# EasyEDA Pro project twibby.epro

# Schematic Schematic
Board Name: rev1.0; Create Date: 2025-04-24; Page Name: P1; Project Name: Twibby; Schematic Name: Schematic; Update Date: 2025-04-24; Company: EasyEDA.com; Page Size: A4; Version: V1.0
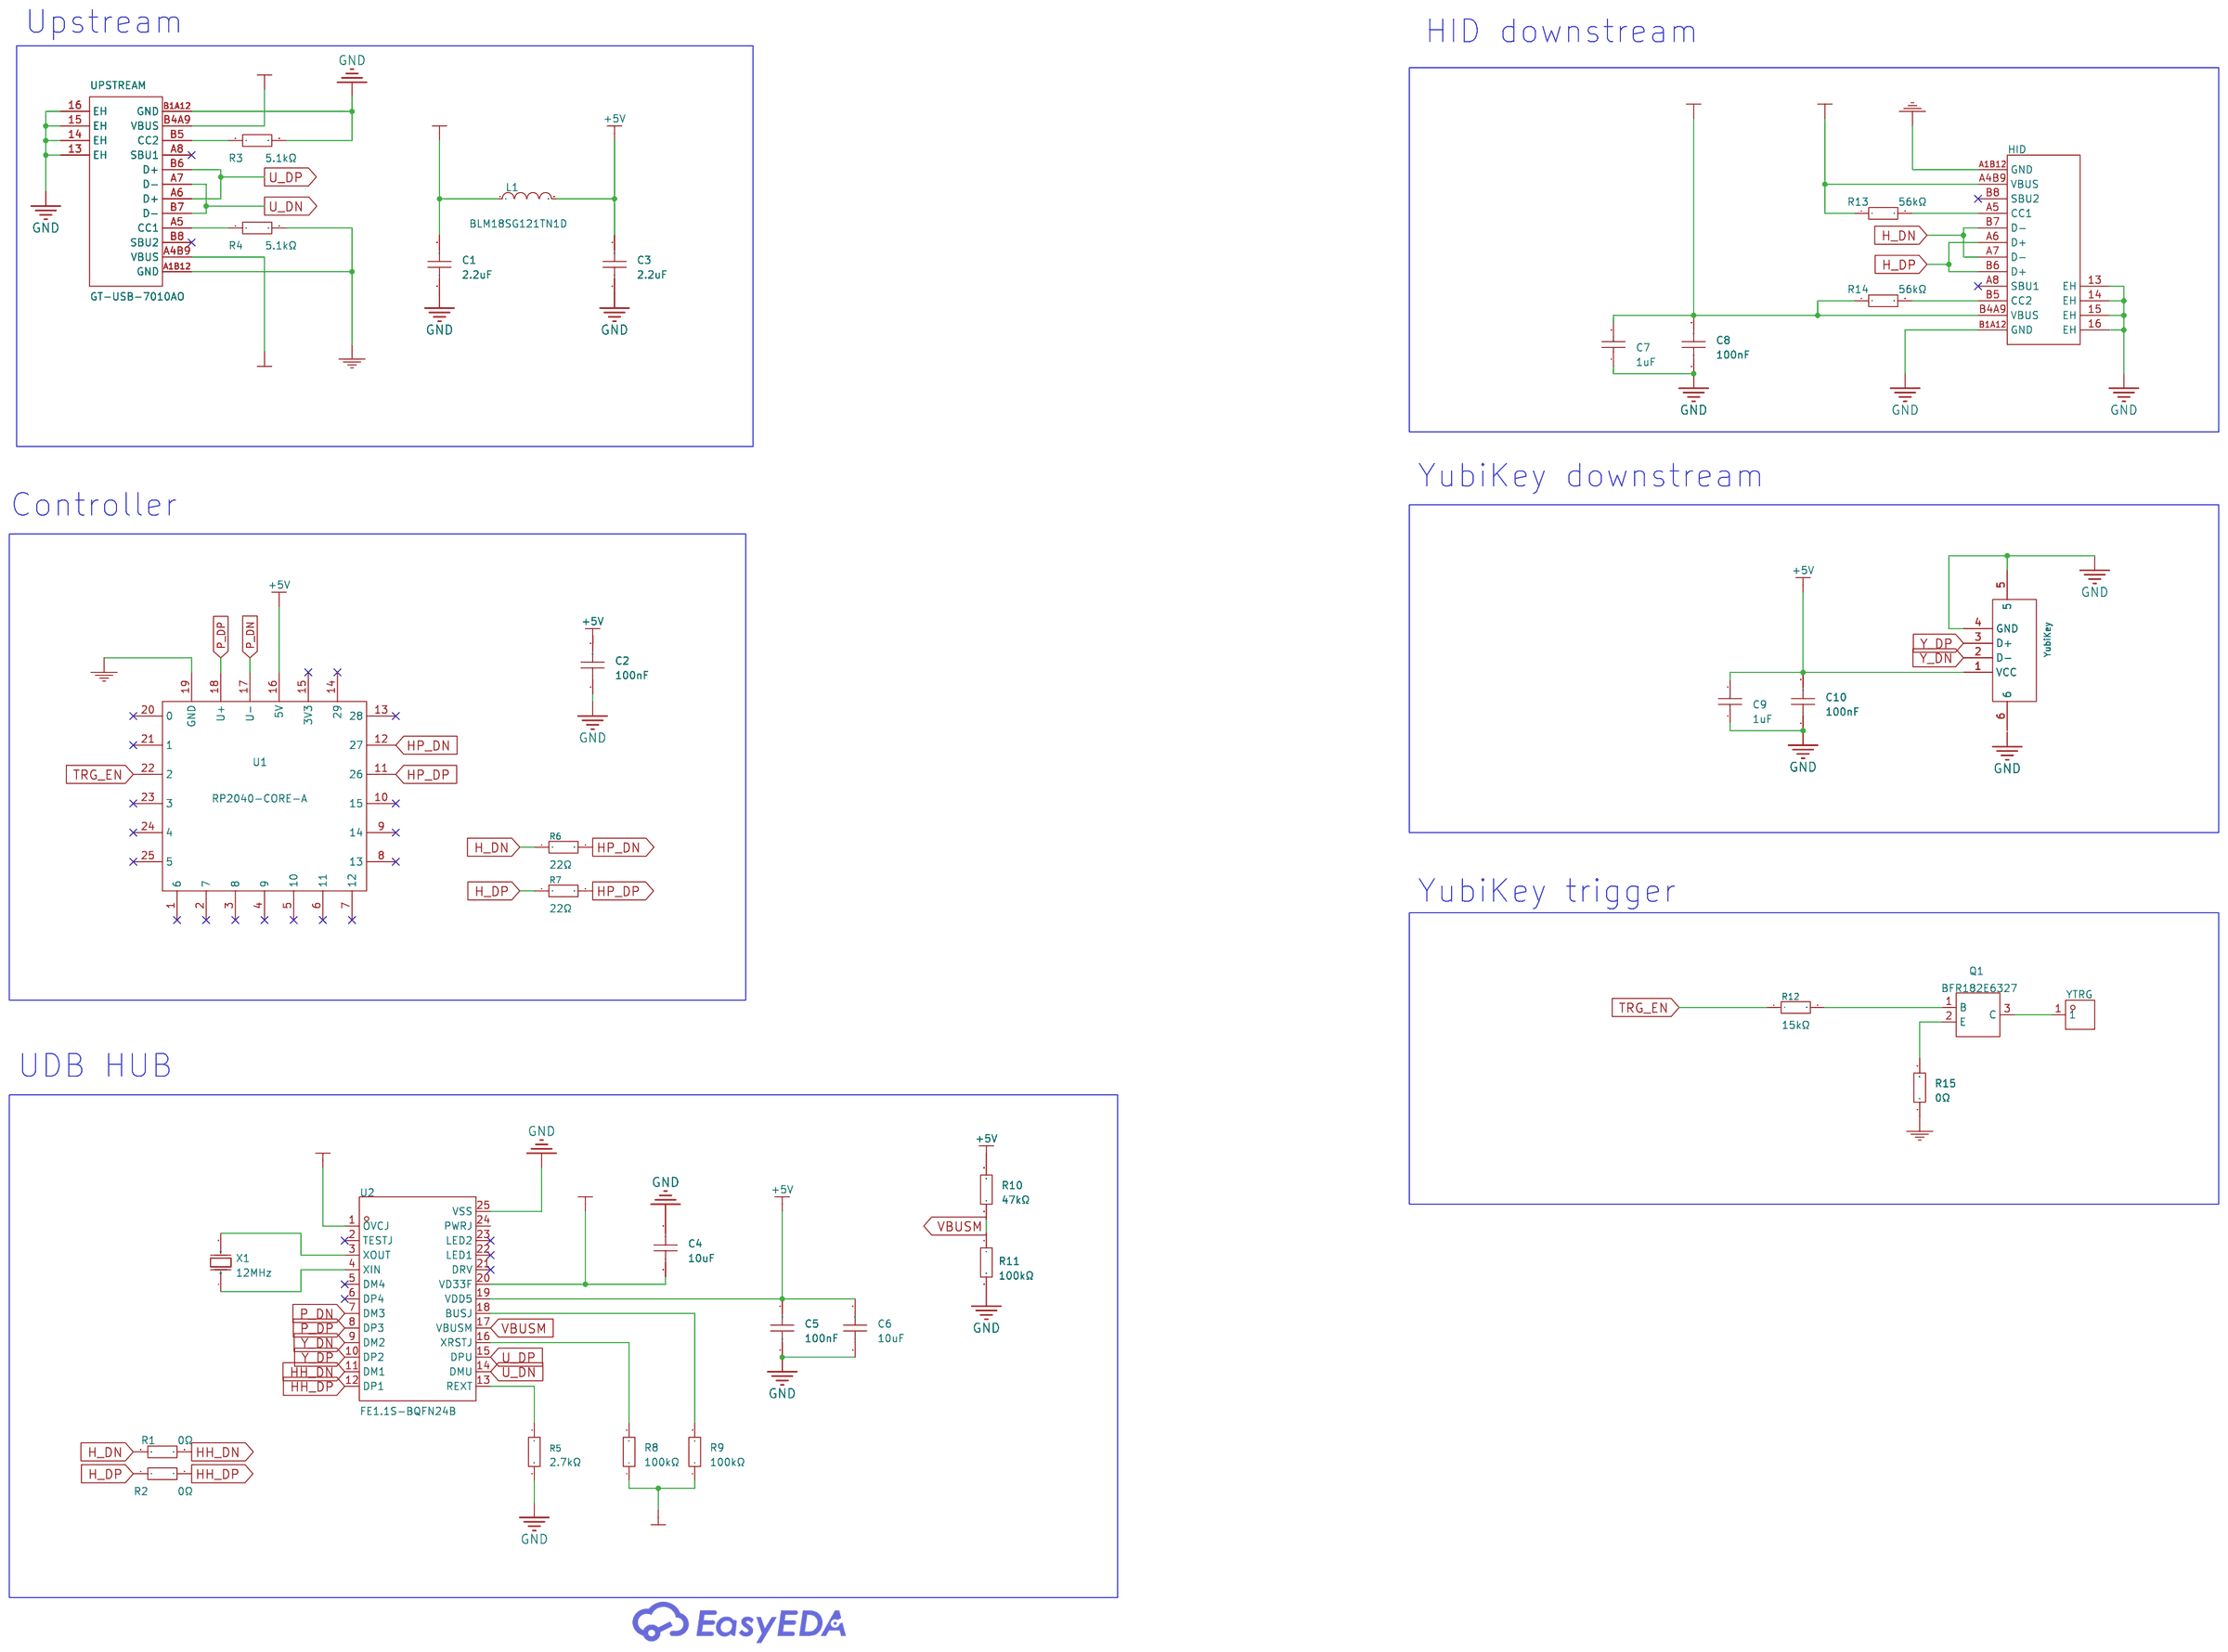
[diagram p0: schematic sheet]

## Parts
C1  2.2uF  [C0805]
C2  100nF  [C0805]
C3  2.2uF  [C0805]
C4  10uF  [C0603]
C5  100nF  [C0402]
C6  10uF  [C0603]
C7  1uF  [C0805]
C8  100nF  [C0805]
C9  1uF  [C0805]
C10  100nF  [C0805]
HID  GT-USB-7010AO  [USB-C-SMD_TYPEC-304J-BCP16]
L1  BLM18SG121TN1D  [L0603]
Q1  BFR182E6327  [SOT-23-3_L2.9-W1.3-P1.90-LS2.4-BR]
R1  0Ω  [R0603]
R2  0Ω  [R0603]
R3  5.1kΩ  [R0402]
R4  5.1kΩ  [R0402]
R5  2.7kΩ  [R0603]
R6  22Ω  [R0402]
R7  22Ω  [R0402]
R8  100kΩ  [R0402]
R9  100kΩ  [R0402]
R10  47kΩ  [R0402]
R11  100kΩ  [R0402]
R12  15kΩ  [R0603]
R13  56kΩ  [R0603]
R14  56kΩ  [R0603]
R15  0Ω  [R0603]
U1  RP2040-CORE-A  [RP2040-CORE-A]
U2  FE1.1S-BQFN24B  [WQFN-24_L4.0-W4.0-P0.50-TL-EP2.7]
UPSTREAM  GT-USB-7010AO  [USB-C-SMD_TYPEC-304J-BCP16]
X1  12MHz  [OSC-SMD_L5.0-W3.2]
YTRG  5017  [CONN-SMD_5017]
YubiKey  912-121A2026S10100  [USB-A-TH_C42425]

## Library data of the parts
C1 C3 = CL21A225KBQNNNE: Capacitance: Tolerance:±10% Tolerance:±10% Voltage Rated: Temperature Coefficient:; LCSC Part Name: 2.2uF ±10% 50V; Supplier Part: C377773; Manufacturer: SAMSUNG(三星); Supplier Footprint: 0805; JLCPCB Part Class: Basic Part; Datasheet: https://atta.szlcsc.com/upload/public/pdf/source/20160218/1457707763339.pdf; Supplier: LCSC; Tolerance: ±10%
C2 C8 C10 = CL21B104KCFNNNE: Capacitance: Tolerance:±10% Tolerance:±10% Voltage Rated: Temperature Coefficient:; LCSC Part Name: 100nF ±10% 100V; Supplier Part: C28233; Manufacturer: SAMSUNG(三星); Supplier Footprint: 0805; JLCPCB Part Class: Basic Part; Datasheet: https://atta.szlcsc.com/upload/public/pdf/source/20160218/1457707763339.pdf; Supplier: LCSC; Tolerance: ±10%
C4 C6 = CL10A106KP8NNNC: Capacitance: Tolerance:±10% Tolerance:±10% Voltage Rated: Temperature Coefficient:; LCSC Part Name: 10uF ±10% 10V; Supplier Part: C19702; Manufacturer: SAMSUNG(三星); Supplier Footprint: 0603; JLCPCB Part Class: Basic Part; Datasheet: https://atta.szlcsc.com/upload/public/pdf/source/20160218/1457707763339.pdf; Supplier: LCSC; Tolerance: ±10%
C5 = 100nF: Supplier: LCSC; Manufacturer Part: CL05B104KO5NNNC; Manufacturer: SAMSUNG(三星); Supplier Part: C1525; JLCPCB Part Class: Basic Part; nameAlias: Value; spicePre: C; spiceSymbolName: CL05B104KO5NNNC
C7 C9 = 0805B105K500NT_C215803: Capacitance:1uF Tolerance:±10% Tolerance:±10% Voltage Rating:50V Temperature Coefficient:X7R; LCSC Part Name: 1uF ±10% 50V; Supplier Part: C215803; Manufacturer: FH(风华); Manufacturer Part: 0805B105K500NT; Supplier Footprint: 0805; JLCPCB Part Class: Extended Part; Datasheet: https://atta.szlcsc.com/upload/public/pdf/source/20180530/C215803_D57791C2287FC18831C4E0C7838E6BEC.pdf; Supplier: LCSC; Tolerance: ±10%; Voltage Rating: 50V; Temperature Coefficient: X7R
HID UPSTREAM = GT-USB-7010AO: Connector Type:Type-C Protocol Standard:USB 2.0 Gender:Female Mounting Type:Horizontal attachment Number of Contacts:16P Number of Ports:1 Current Rating-Power:5A Voltage Rating:24V Connect-Disconnect Life:10,000 times Center Height:1.68mm Length:7.35mm D; LCSC Part Name: Type-C 母 卧贴; Supplier Part: C963413; Manufacturer: G-Switch(品赞); Supplier Footprint: SMD; JLCPCB Part Class: Extended Part; Datasheet: https://atta.szlcsc.com/upload/public/pdf/source/20231219/85271B2F6473C1B77DCA32EC6F809B43.pdf; Supplier: LCSC; Connector Type: Type-C; Protocol Standard: USB 2.0; Gender: Female; Mounting Type: Horizontal attachment; Number of Contacts: 16P; Number of Ports: 1; Current Rating-Power: 5A; Voltage Rating: 24V; Connect-Disconnect Life: 10,000 times; Center Height: 1.68mm; Length: 7.35mm; Detection color: Orange; Operating Temperature: -40℃~+85℃
L1 = BLM18SG121TN1D: Impedance @ Frequency:120Ω@100MHz Tolerance:±25% Tolerance:±25% DC Resistance:25mΩ Current Rating:3A Circuits:1; LCSC Part Name: 单路 0603磁珠 阻抗120Ω@100MHz; Supplier Part: C113030; Manufacturer: muRata(村田); Supplier Footprint: 0603; JLCPCB Part Class: Extended Part; Datasheet: https://atta.szlcsc.com/upload/public/pdf/source/20170523/1495533956547.pdf; Supplier: LCSC; Impedance @ Frequency: 120Ω@100MHz; Tolerance: ±25%; DC Resistance: 25mΩ; Current Rating: 3A; Circuits: 1
Q1 = BFR182E6327: Supplier: LCSC; Supplier Part: C178311; Manufacturer: Infineon(英飞凌); JLCPCB Part Class: Extended Part; Contributor: LCSC; spicePre: Q
R1 R2 = 0603WAF0000T5E: Type:Thick Film Resistors Resistance: Tolerance:±1% Tolerance:±1% Power(Watts): Overload Voltage (Max): Operating Temperature Range:-55℃~+155℃ Operating Temperature Range:-55℃~+155℃; LCSC Part Name: 0Ω ±1% 100mW 厚膜电阻; Supplier Part: C21189; Manufacturer: UNI-ROYAL(厚声); Supplier Footprint: 0603; JLCPCB Part Class: Basic Part; Datasheet: https://atta.szlcsc.com/upload/public/pdf/source/20200306/C422600_1E6D84923E4A46A82E41ADD87F860B5C.pdf; Supplier: LCSC; Type: Thick Film Resistors; Tolerance: ±1%; Operating Temperature Range: -55℃~+155℃
R3 R4 = 5.1kΩ: Supplier: LCSC; Manufacturer: UNI-ROYAL(厚声); Manufacturer Part: 0402WGF5101TCE; Supplier Part: C25905; JLCPCB Part Class: Basic Part; nameAlias: Value; spicePre: R; spiceSymbolName: 0402WGF5101TCE
R5 = 0603WAF2701T5E: Type:Thick Film Resistors Resistance:2.7kΩ Tolerance:±1% Tolerance:±1% Power(Watts): Overload Voltage (Max): Temperature Coefficient:±100ppm/℃ Temperature Coefficient:±100ppm/℃ Operating Temperature Range:-55℃~+155℃ Operating Temperature Range:-55℃~+155℃; LCSC Part Name: 2.7kΩ ±1% 100mW 厚膜电阻; Supplier Part: C13167; Manufacturer: UNI-ROYAL(厚声); Supplier Footprint: 0603; JLCPCB Part Class: Basic Part; Datasheet: https://atta.szlcsc.com/upload/public/pdf/source/20200306/C422600_1E6D84923E4A46A82E41ADD87F860B5C.pdf; Supplier: LCSC; Type: Thick Film Resistors; Tolerance: ±1%; Temperature Coefficient: ±100ppm/℃; Operating Temperature Range: -55℃~+155℃
R6 R7 = 0402WGF220JTCE: Type:Thick Film Resistors Resistance:22Ω Tolerance:±1% Tolerance:±1% Power(Watts): Overload Voltage (Max): Temperature Coefficient:±100ppm/℃ Temperature Coefficient:±100ppm/℃ Operating Temperature Range:-55℃~+155℃ Operating Temperature Range:-55℃~+155℃; LCSC Part Name: 22Ω ±1% 62.5mW 厚膜电阻; Supplier Part: C25092; Manufacturer: UNI-ROYAL(厚声); Supplier Footprint: 0402; JLCPCB Part Class: Basic Part; Datasheet: https://atta.szlcsc.com/upload/public/pdf/source/20200306/C422600_1E6D84923E4A46A82E41ADD87F860B5C.pdf; Supplier: LCSC; Type: Thick Film Resistors; Tolerance: ±1%; Temperature Coefficient: ±100ppm/℃; Operating Temperature Range: -55℃~+155℃
R8 R9 R11 = 100kΩ: Supplier: LCSC; Manufacturer: UNI-ROYAL(厚声); Manufacturer Part: 0402WGF1003TCE; Supplier Part: C25741; JLCPCB Part Class: Basic Part; nameAlias: Value; spicePre: R; spiceSymbolName: 0402WGF1003TCE
R10 = 0402WGF4702TCE: Type:Thick Film Resistors Resistance:47kΩ Tolerance:±1% Tolerance:±1% Power(Watts): Overload Voltage (Max): Temperature Coefficient:±100ppm/℃ Temperature Coefficient:±100ppm/℃ Operating Temperature Range:-55℃~+155℃ Operating Temperature Range:-55℃~+155℃; LCSC Part Name: 47kΩ ±1% 62.5mW 厚膜电阻; Supplier Part: C25792; Manufacturer: UNI-ROYAL(厚声); Supplier Footprint: 0402; JLCPCB Part Class: Basic Part; Datasheet: https://atta.szlcsc.com/upload/public/pdf/source/20200306/C422600_1E6D84923E4A46A82E41ADD87F860B5C.pdf; Supplier: LCSC; Type: Thick Film Resistors; Tolerance: ±1%; Temperature Coefficient: ±100ppm/℃; Operating Temperature Range: -55℃~+155℃
R12 = 0603WAF1502T5E: Type:Thick Film Resistors Resistance:15kΩ Tolerance:±1% Tolerance:±1% Power(Watts): Overload Voltage (Max): Temperature Coefficient:±100ppm/℃ Temperature Coefficient:±100ppm/℃ Operating Temperature Range:-55℃~+155℃ Operating Temperature Range:-55℃~+155℃; LCSC Part Name: 15kΩ ±1% 100mW 厚膜电阻; Supplier Part: C22809; Manufacturer: UNI-ROYAL(厚声); Supplier Footprint: 0603; JLCPCB Part Class: Basic Part; Datasheet: https://atta.szlcsc.com/upload/public/pdf/source/20200306/C422600_1E6D84923E4A46A82E41ADD87F860B5C.pdf; Supplier: LCSC; Type: Thick Film Resistors; Tolerance: ±1%; Temperature Coefficient: ±100ppm/℃; Operating Temperature Range: -55℃~+155℃
R13 R14 = 0603WAF5602T5E: Type:Thick Film Resistors Resistance:56kΩ Tolerance:±1% Tolerance:±1% Power(Watts): Overload Voltage (Max): Temperature Coefficient:±100ppm/℃ Temperature Coefficient:±100ppm/℃ Operating Temperature Range:-55℃~+155℃ Operating Temperature Range:-55℃~+155℃; LCSC Part Name: 56kΩ ±1% 100mW 厚膜电阻; Supplier Part: C23206; Manufacturer: UNI-ROYAL(厚声); Supplier Footprint: 0603; JLCPCB Part Class: Basic Part; Datasheet: https://atta.szlcsc.com/upload/public/pdf/source/20200306/C422600_1E6D84923E4A46A82E41ADD87F860B5C.pdf; Supplier: LCSC; Type: Thick Film Resistors; Tolerance: ±1%; Temperature Coefficient: ±100ppm/℃; Operating Temperature Range: -55℃~+155℃
R15 = 0Ω: Supplier: LCSC; Manufacturer: UNI-ROYAL(厚声); Manufacturer Part: 0603WAF0000T5E; Supplier Part: C21189; JLCPCB Part Class: Basic Part; nameAlias: Value; spicePre: R; spiceSymbolName: 0603WAF0000T5E
U1 = RP2040-CORE-A: Contributor: leeklabsinternational; spicePre: U; spiceSymbolName: RP2040-CORE-A COPY
U2 = FE1.1S-BQFN24B: LCSC Part Name: USB 2.0 4-端口集线器控制器; Supplier Part: C6776948; Manufacturer: TERMINUS; Supplier Footprint: WQFN-24; JLCPCB Part Class: Extended Part; Datasheet: https://atta.szlcsc.com/upload/public/pdf/source/20230614/ED67D6CC784350C7C68F98E68B5A1A46.pdf; Supplier: LCSC
X1 = TAXM12M2QLFCDT1T: Type:Surface Mount Crystal Frequency:12MHz Normal temperature Frequency Tolerance:±30ppm Normal temperature Frequency Tolerance:±30ppm Load Capacitance: Frequency Stability:±30ppm Frequency Stability:±30ppm Equivalent Series Resistance(ESR):30Ω Operating; LCSC Part Name: 12MHz ±30ppm 20pF; Supplier Part: C122521; Manufacturer: YJX(雅晶鑫); Supplier Footprint: SMD5032; JLCPCB Part Class: Extended Part; Datasheet: https://atta.szlcsc.com/upload/public/pdf/source/20170729/1501323383520.pdf; Supplier: LCSC; Type: Surface Mount Crystal; Normal temperature Frequency Tolerance: ±30ppm; Frequency Stability: ±30ppm; Equivalent Series Resistance(ESR): 30Ω; Operating Temperature: -40℃~+85℃
YTRG = 5017: Supplier Part: C9900015874; Supplier Footprint: Testpoint_SMD; JLCPCB Part Class: Extended Part; Supplier: LCSC
YubiKey = 912-121A2026S10100: Connector Type:Type-A Standard:USB 2.0 Gender:Female Number of Ports:1 Number of Contacts:4P; LCSC Part Name: Type-A 母; Supplier Part: C42425; Manufacturer: 精拓金; Supplier Footprint: SMD; JLCPCB Part Class: Extended Part; Datasheet: https://atta.szlcsc.com/upload/public/pdf/source/20210226/C42425_EB3A4E8284A30A8B7B8F7DB75A32293A.pdf; Supplier: LCSC; Connector Type: Type-A; Standard: USB 2.0; Gender: Female; Number of Ports: 1; Number of Contacts: 4P

## Nets
+3V3: C4.1 R8.1 R9.1 U2.1(OVCJ) U2.20(VD33F)
+5V: C2.2 C3.2 C5.2 C6.2 C7.2 C8.2 C9.2 C10.2 HID.A4B9(VBUS) HID.B4A9(VBUS) L1.2 R10.2 R13.1 R14.1 U1.16(5V) U2.19(VDD5) YubiKey.1(VCC)
+5V_IN: C1.2 L1.1 UPSTREAM.A4B9(VBUS) UPSTREAM.B4A9(VBUS)
GND: C1.1 C2.1 C3.1 C4.2 C5.1 C6.1 C7.1 C8.1 C9.1 C10.1 HID.13(EH) HID.14(EH) HID.15(EH) HID.16(EH) HID.A1B12(GND) HID.B1A12(GND) R3.2 R4.2 R5.2 R11.2 R15.1 U1.19(GND) U2.25(VSS) UPSTREAM.13(EH) UPSTREAM.14(EH) UPSTREAM.15(EH) UPSTREAM.16(EH) UPSTREAM.A1B12(GND) UPSTREAM.B1A12(GND) YubiKey.4(GND) YubiKey.5
VBUSM: R10.1 R11.1 U2.17(VBUSM)
H_DN: HID.A7(D-) HID.B7(D-) R1.1 R6.1
H_DP: HID.A6(D+) HID.B6(D+) R2.1 R7.1
HH_DN: R1.2 U2.11(DM1)
HH_DP: R2.2 U2.12(DP1)
HP_DN: R6.2 U1.12(27)
HP_DP: R7.2 U1.11(26)
P_DN: U1.17(U-) U2.7(DM3)
P_DP: U1.18(U+) U2.8(DP3)
TRG_EN: R12.1 U1.22(2)
U_DN: U2.14(DMU) UPSTREAM.A7(D-) UPSTREAM.B7(D-)
U_DP: U2.15(DPU) UPSTREAM.A6(D+) UPSTREAM.B6(D+)
Y_DN: U2.9(DM2) YubiKey.2(D-)
Y_DP: U2.10(DP2) YubiKey.3(D+)
$3N2109: R3.1 UPSTREAM.B5(CC2)
$3N2111: R4.1 UPSTREAM.A5(CC1)
$3N2118: HID.B5(CC2) R14.2
$3N2120: HID.A5(CC1) R13.2
$3N2134: Q1.2(E) R15.2
$3N2136: Q1.3(C) YTRG.1
$3N2137: Q1.1(B) R12.2
$3N2140: U2.3(XOUT) X1.2(OSC2)
$3N2141: U2.4(XIN) X1.1(OSC1)
$3N2147: R8.2 U2.16(XRSTJ)
$3N2150: R9.2 U2.18(BUSJ)
$3N2703: R5.1 U2.13(REXT)

Not connected (* = marked no-connect by the designer): HID A8(SBU1)* B8(SBU2)*; U1 1(6)* 2(7)* 3(8)* 4(9)* 5(10)* 6(11)* 7(12)* 8(13)* 9(14)* 10(15)* 13(28)* 14(29)* 15(3V3)* 20(0)* 21(1)* 23(3)* 24(4)* 25(5)*; U2 2(TESTJ)* 5(DM4)* 6(DP4)* 21(DRV)* 22(LED1)* 23(LED2)* 24(PWRJ); UPSTREAM A8(SBU1)* B8(SBU2)*; YubiKey 6

## Notes on the sheet
- Upstream
- HID downstream
- YubiKey downstream
- Controller
- YubiKey trigger
- UDB HUB

# Board PCB
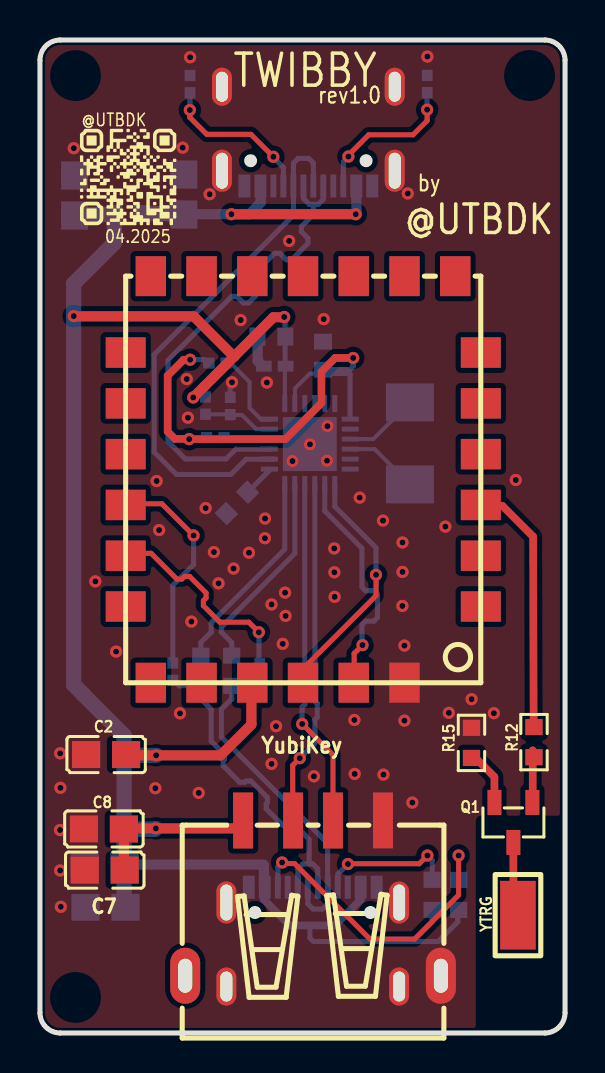
[diagram p1: board, top side]
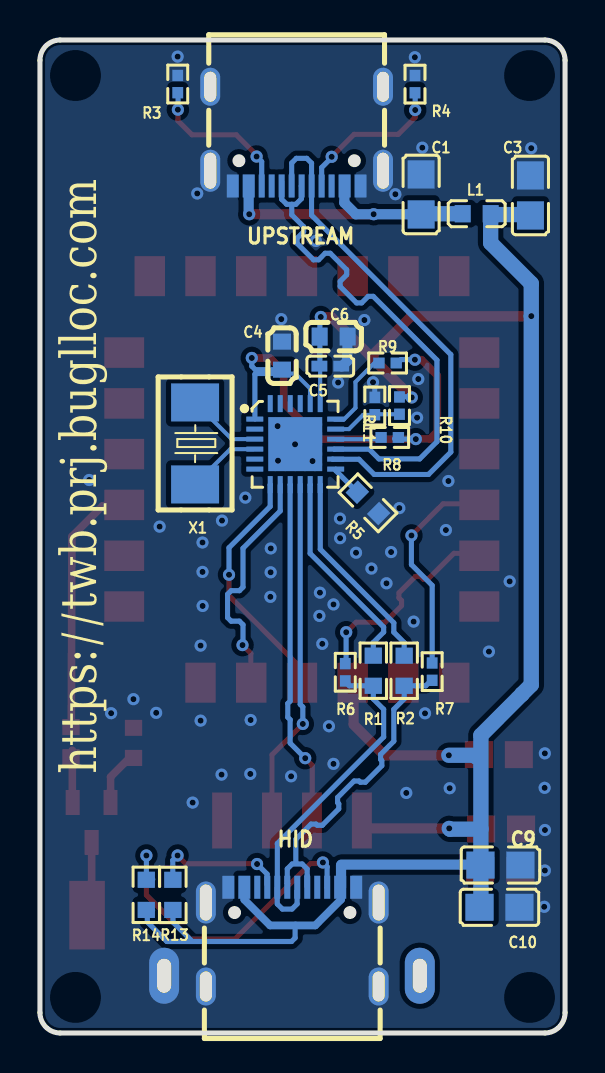
[diagram p2: board, bottom side, seen from below]

Outline 26.29 x 49.66 mm; copper layers: Top Layer, Inner1, Inner2, Bottom Layer. Coordinates in mm from the lower left corner of the outline.
Outline path: 0,48.64 0,1.02 arc(0.3,0.3) 1.02,0 25.27,0 arc(25.99,0.3) 26.29,1.02 26.29,48.64 arc(25.99,49.36) 25.27,49.66 1.02,49.66 arc(0.3,49.36) 0,48.64
Stack: Top Layer 0.035mm Outer layer thickness 1oz / Dielectric1 0.2104mm 7628 RC49% 8.6mil / Inner1 0.0152mm Inner layer thickness / Dielectric2 1.065mm 1.1mm H/HOZ Copper / Inner2 0.0152mm Inner layer thickness / Dielectric3 0.2104mm 7628 RC49% 8.6mil / Bottom Layer 0.035mm Outer layer thickness 1oz

## Design rules (mm)
net H_DP: DP7
net H_DN: DP7
net P_DN: DP3
net P_DP: DP3
net Y_DN: DP4
net Y_DP: DP4
net U_DN: DP5
net U_DP: DP5
net HH_DN: DP8
net HH_DP: DP8
net HP_DP: DP6
net HP_DN: DP6
template: Custom Config
spacing copperThickness1oz (default): track to track 0.102, other pairs 0.152 to 0.3
spacing copperThickness2oz: track to track 0.203, other pairs 0.152 to 0.3
track width copperThickness1oz (default): min 0.127, default 0.254, max 2.54
track width copperThickness2oz: min 0.203, default 0.254, max 2.54
differential pair differentialPair (default): width min 0.127, default 0.254, max 2.54; gap min 0.152, default 0.254
via viaSize (default): diameter min 0.5, default 0.61, max 10; hole min 0.3, default 0.305, max 6.3

## Placement (name value [footprint] x y rotation side)
C1  2.2uF  [C0805]  7.21 41.93 270 bottom
C2  100nF  [C0805]  3.31 13.92 0 top
C3  2.2uF  [C0805]  1.73 41.88 270 bottom
C4  10uF  [C0603]  14.17 33.87 90 bottom
C5  100nF  [C0402]  11.75 33.35 0 bottom
C6  10uF  [C0603]  11.59 34.82 0 bottom
C7  1uF  [C0805]  3.24 8.15 0 top
C8  100nF  [C0805]  3.2 10.2 0 top
C9  1uF  [C0805]  3.28 6.29 0 bottom
C10  100nF  [C0805]  3.23 8.4 0 bottom
HID  GT-USB-7010AO  [USB-C-SMD_TYPEC-304J-BCP16]  13.66 4.81 180 bottom
L1  BLM18SG121TN1D  [L0603]  4.42 40.97 180 bottom
Q1  BFR182E6327  [SOT-23-3_L2.9-W1.3-P1.90-LS2.4-BR]  23.7 10.53 90 top
R1  0Ω  [R0603]  9.6 18.12 90 bottom
R2  0Ω  [R0603]  8.05 18.11 90 bottom
R3  5.1kΩ  [R0402]  19.39 47.45 90 bottom
R4  5.1kΩ  [R0402]  7.51 47.45 90 bottom
R5  2.7kΩ  [R0603]  9.86 26.51 225 bottom
R6  22Ω  [R0402]  11 18.04 90 bottom
R7  22Ω  [R0402]  6.65 18.07 90 bottom
R8  100kΩ  [R0402]  8.78 29.78 0 bottom
R9  100kΩ  [R0402]  8.88 33.5 0 bottom
R10  47kΩ  [R0402]  8.29 31.37 90 bottom
R11  100kΩ  [R0402]  9.53 31.35 90 bottom
R12  15kΩ  [R0603]  24.73 14.55 270 top
R13  56kΩ  [R0603]  19.64 6.91 90 bottom
R14  56kΩ  [R0603]  20.97 6.91 90 bottom
R15  0Ω  [R0603]  21.6 14.51 270 top
U1  -  [RP2040-CORE-A]  22.07 37.85 180 top
U2  FE1.1S-BQFN24B  [WQFN-24_L4.0-W4.0-P0.50-TL-EP2.7]  13.51 29.45 180 bottom
UPSTREAM  GT-USB-7010AO  [USB-C-SMD_TYPEC-304J-BCP16]  13.44 44.84 0 bottom
X1  12MHz  [OSC-SMD_L5.0-W3.2]  18.52 29.48 90 bottom
YTRG  5017  [CONN-SMD_5017]  23.93 5.89 270 top
YubiKey  912-121A2026S10100  [USB-A-TH_C42425]  13.67 6.75 0 top

## Footprints (pads in the part's own frame, mm; a bottom-side part is the same pattern mirrored in y, then rotated)
C0402
  rect 0.79x0.54 smd: 1(-0.545,0) 2(0.545,0)
C0603
  rect 0.8x0.9 smd: 1(-0.7,0) 2(0.7,0)
C0805
  rect 1.41x1.35 smd: 1(-1,0) 2(1,0)
CONN-SMD_5017
  rect 3.43x1.78 smd: 1(0,0)
L0603
  rect 0.8x0.864 smd: 1(-0.7,0) 2(0.7,0)
OSC-SMD_L5.0-W3.2
  rect 1.9x2.4 smd: 1(-2.05,0) 2(2.05,0)
R0402
  rect 0.566x0.54 smd: 1(-0.433,0) 2(0.433,0)
R0603
  rect 0.806x0.864 smd: 1(-0.753,0) 2(0.753,0)
RP2040-CORE-A
  rect 1.524x2 smd: 1(1.28,0) 2(3.82,0) 3(6.36,0) 4(8.9,0) 5(11.44,0) 6(13.98,0) 7(16.52,0) 14(16.52,20.33) 15(13.98,20.33) 16(11.44,20.33) 17(8.9,20.33) 18(6.36,20.33) 19(3.82,20.33)
  rect 2x1.524 smd: 8(17.78,3.82) 9(17.78,6.36) 10(17.78,8.9) 11(17.78,11.44) 12(17.78,13.98) 13(17.78,16.52) 20(0,16.52) 21(0,13.98) 22(0,11.44) 23(0,8.9) 24(0,6.36) 25(0,3.82)
SOT-23-3_L2.9-W1.3-P1.90-LS2.4-BR
  rect 1.25x0.7 smd: 1(1,-0.95) 2(1,0.95) 3(-1,0)
USB-A-TH_C42425
  rect 1x2.8 smd: 1(-3.5,3.882) 2(-1,3.882) 3(1,3.882) 4(3.5,3.882)
  oval 1.5x2.8 hole 0.7x1.7: 5(6.4,-3.882) 6(-6.4,-3.882)
USB-C-SMD_TYPEC-304J-BCP16
  oval 1x2.1 hole 0.6x1.8: 13(-4.325,1.718) 14(4.325,1.718)
  oval 1x1.9 hole 0.6x1.5: 15(-4.325,-2.482) 16(4.325,-2.482)
  rect 0.6x1.15 smd: A1B12(-3.2,2.482) A4B9(-2.4,2.482) B1A12(3.2,2.482) B4A9(2.4,2.482)
  rect 0.3x1.15 smd: A5(-1.25,2.482) A6(-0.25,2.482) A7(0.25,2.482) A8(1.25,2.482) B5(1.75,2.482) B6(0.75,2.482) B7(-0.75,2.482) B8(-1.75,2.482)
WQFN-24_L4.0-W4.0-P0.50-TL-EP2.7
  rect 0.85x0.25 smd: 1(-2.025,1.25) 2(-2.025,0.75) 3(-2.025,0.25) 4(-2.025,-0.25) 5(-2.025,-0.75) 6(-2.025,-1.25) 13(2.025,-1.25) 14(2.025,-0.75) 15(2.025,-0.25) 16(2.025,0.25) 17(2.025,0.75) 18(2.025,1.25)
  rect 0.25x0.85 smd: 7(-1.25,-2.025) 8(-0.75,-2.025) 9(-0.25,-2.025) 10(0.25,-2.025) 11(0.75,-2.025) 12(1.25,-2.025) 19(1.25,2.025) 20(0.75,2.025) 21(0.25,2.025) 22(-0.25,2.025) 23(-0.75,2.025) 24(-1.25,2.025)
  rect 2.7x2.7 smd: 25(0.001,0)

## Nets
As in the schematic.

Pads without a net: HID A8 B8; U1 1 2 3 4 5 6 7 8 9 10 13 14 15 20 21 23 24 25; U2 2 5 6 21 22 23 24; UPSTREAM A8 B8; YubiKey 6

## Via types
v1: diameter 0.61, hole 0.305, Top Layer to Bottom Layer, 87 vias

## Routing (per net, layer and track width the routed paths; a pad name or vN(x,y) marks a point on that pad's centre or on a via; arc(x,y) is an arc through that point)
+3V3: length 26.5
  Top Layer w0.254: 14.09,31.5 14.09,31.5
  Top Layer w0.381: v1(7.52,33.67) 7.19,33.67 6.39,32.87 6.39,30.07 6.76,29.71 7.46,29.71 v1(7.47,29.7) 12.29,29.7 14.09,31.5 14.09,33.07 14.78,33.76 v1(15.68,33.76)
  Bottom Layer w0.203: 12.77,31.5 12.77,32.23 13.51,32.97 13.97,32.97 C4.1
  Bottom Layer w0.254: 14.15,33.17 15.51,33.17 15.68,33.35 v1(15.68,33.76) ; C4.1 14.36,32.98 15.5,32.98 15.53,32.95 15.53,30.7 ; 8.54,29.72 8.51,29.7 v1(7.47,29.7) ; 8.39,33.5 8.21,33.68 7.56,33.68
+5V: length 105.2
  Top Layer w0.508: 9.69,33.85 7.7,35.84 1.7,35.84 v1(1.69,35.85) ; 9.69,33.85 9.69,33.79 8.22,32.32 ; 9.69,33.85 9.74,33.85 11.69,35.79 12.22,35.79 v1(12.23,35.81) ; 4.2,8.32 4.2,9.99 4.44,10.23 9.78,10.23 YubiKey.1 ; 10.83,17.47 10.82,17.48 ; v1(7.67,31.78) 8.22,32.32 ; 10.83,17.29 10.59,17.04 10.59,15.43 9.04,13.89 4.55,13.89 4.41,13.75 4.24,13.92
  Top Layer w0.762: 4.23,8.29 4.2,8.32
  Bottom Layer w0.203: 12.28,33.33 C5.2 ; 12.26,31.47 12.26,33.31
  Bottom Layer w0.254: 17.9,4.58 13.69,4.58 13.51,4.76 13.51,5.36 13.5,5.38 13.5,5.41 ; v1(12.23,35.81) 12.28,35.76 12.28,33.33 ; 20.65,6.13 20.91,5.87 20.91,5.55 19.94,4.58 18.66,4.58 ; 18.66,4.58 19.63,5.54 19.63,5.91 19.44,6.1 ; 18.66,4.58 17.92,4.58 ; v1(7.67,31.78) 7.71,31.82 8.28,31.82
  Bottom Layer w0.381: 11.22,7.29 11.22,6.67 12.51,5.38 14.77,5.38 16.06,6.67 16.06,7.27
  Bottom Layer w0.508: 16.03,7.29 16.03,7.23 ; 11.22,7.29 11.22,8.39 ; 11.19,8.42 4.26,8.42 C10.2 ; C9.2 4.26,6.26 4.21,6.26
  Bottom Layer w0.762: v1(5.82,13.89) 4.53,13.89 4.46,13.82 4.41,13.87 ; 4.21,10.19 4.21,6.26 4.25,6.07 ; 4.21,10.19 4.21,14.88 2.15,16.94 2.15,16.95 1.69,17.41 v1(1.69,35.85) 1.69,37.48 3.72,39.51 3.72,40.92 3.73,40.92 ; 4.21,10.19 5.76,10.19 v1(5.8,10.23) ; 3.69,40.93 1.91,40.93
+5V_IN: length 14.9
  Top Layer w0.508: v1(15.81,40.94) 9.71,40.94
  Bottom Layer w0.508: 15.84,42.56 15.84,40.97 v1(15.81,40.94) ; v1(9.58,40.94) 7.21,40.94 7.18,40.97 ; 9.58,40.94 10.47,40.94 11.05,41.52 11.05,42.55 11.04,42.56
  Bottom Layer w0.762: 7.18,40.97 5.16,40.97
GND: length 2.3
  Bottom Layer w0.254: 9.53,31.78 9.53,32.4 9.65,32.52
  Bottom Layer w0.508: 10.89,34.75 10.9,34.73 10.9,33.61 11.18,33.33
  vias: v1(1.01,13.98) v1(1.02,12.26) v1(1.01,10.15) v1(1.01,8.13) v1(1.04,6.31) v1(1.69,44.25) v1(2.77,22.58) v1(3.81,19.07) v1(5.84,27.6) v1(5.78,12.24) v1(5.97,25.15) v1(7.01,15.99) v1(7.15,44.27) v1(7.35,32.7) v1(7.41,30.77) v1(7.52,48.79) v1(7.58,20.57) v1(7.95,12.01) v1(8.3,26.25) v1(8.5,41.94) v1(8.71,24.05) v1(8.94,22.49) v1(9.61,32.54) v1(9.69,23.23) v1(10.05,35.65) v1(10.46,24.02) v1(11.27,25.73) v1(11.26,24.74) v1(11.36,32.53) v1(11.59,21.43) v1(11.59,13.46) v1(11.82,15.34) v1(12.16,19.46) v1(12.27,22.02) v1(12.3,20.86) v1(12.47,39.61) v1(12.64,28.6) v1(13.52,29.44) v1(13.72,12.84) v1(14.21,35.7) v1(14.39,30.35) v1(14.37,28.62) v1(14.73,24.23) v1(14.74,23.04) v1(14.75,21.81) v1(15.74,15.65) v1(15.76,12.96) v1(16.01,26.77) v1(17.17,25.62) v1(17.2,12.92) v1(18.15,24.53) v1(18.15,23.06) v1(18.14,21.36) v1(18.25,19.37) v1(18.25,15.62) v1(18.41,41.98) v1(18.64,11.52) v1(19.4,48.83) v1(20.3,25.32) v1(20.47,16.01) v1(21.61,16.69) v1(22.73,15.99) v1(23.82,27.65)
VBUSM: length 3.7
  Bottom Layer w0.203: 9.69,30.91 10.11,30.91 10.82,30.2 11.58,30.2 ; 8.29,30.94 9.5,30.94 R11.1
  Bottom Layer w0.254: R11.1 9.54,30.91 9.69,30.91 9.69,30.82
H_DN: length 16.4
  Bottom Layer w0.254: 11,17.57 10.8,17.36 R1.1 9.6,16.71 9.08,16.19 9.08,14.8 14.4,9.48 14.4,7.59 ; 13.41,7.11 13.41,6.45 13.67,6.2 14.15,6.2 14.41,6.45 14.41,7.29
H_DP: length 16.3
  Bottom Layer w0.254: 13.47,8.52 13.48,8.54 13.48,9.69 12.72,10.44 12.47,10.44 12.41,10.39 12.15,10.39 11.33,11.21 11.33,11.46 11.39,11.52 11.39,11.78 10.56,12.6 10.31,12.6 10.25,12.54 10,12.54 9.17,13.37 9.17,13.62 9.23,13.68 9.23,13.93 8.57,14.59 8.57,16.19 8.05,16.7 R2.1 6.97,17.36 6.71,17.63 ; 13.88,7.47 13.91,7.49 13.91,8.21 13.66,8.45 13.16,8.45 12.91,8.2 12.91,7.86 12.91,7.85 12.91,7.29
HH_DN: length 10.3
  Bottom Layer w0.254: R1.2 9.6,19.53 9.08,20.05 9.08,20.3 12.76,23.98 12.76,27.42 U2.11
HH_DP: length 10.3
  Bottom Layer w0.254: R2.2 8.05,19.53 8.57,20.04 8.57,20.51 12.25,24.19 12.25,27.42 U2.12
HP_DN: length 10.7
  Top Layer w0.254: v1(10.96,20.04) 10.46,20.54 9.01,20.54 8.18,21.37 8.18,21.62 8.32,21.75 8.32,22.01 7.49,22.83 7.24,22.83 7.11,22.7 6.85,22.7 5.56,23.99 4.16,23.99
  Bottom Layer w0.254: v1(10.96,20.04) 10.96,20.04 10.96,18.45
HP_DP: length 10.7
  Top Layer w0.254: v1(7.69,24.88) 6.11,26.46 4.45,26.46
  Bottom Layer w0.254: 6.65,18.5 6.65,22.38 7.69,23.42 7.69,24.87
P_DN: length 12.4
  Top Layer w0.254: v1(16.82,22.91) 16.83,22.91 16.83,21.87 13.06,18.1 13.06,17.71 13.22,17.55
  Bottom Layer w0.254: v1(16.82,22.91) 16.82,24.27 14.76,26.33 14.76,27.42 U2.7
P_DP: length 12.2
  Top Layer w0.254: v1(16.15,19.4) 15.73,18.98 15.73,17.29
  Bottom Layer w0.254: v1(16.15,19.4) 16.12,19.42 16.12,20.41 16.3,20.59 16.72,20.59 16.9,20.77 16.9,21.94 16.72,22.12 16.3,22.12 16.12,22.3 16.12,24.24 14.26,26.1 U2.8
TRG_EN: length 12.5
  Top Layer w0.381: 24.72,15.38 24.69,24.82 23.15,26.37 22.26,26.37
U_DN: length 25.8
  Bottom Layer w0.254: 13.69,42.94 13.69,42.94 13.69,43.51 13.45,43.74 12.93,43.74 12.69,43.5 12.69,40.9 5.72,33.92 5.72,29.05 6.84,27.93 9.56,27.93 10.32,28.69 11.63,28.69 11.64,28.7
U_DP: length 25.7
  Bottom Layer w0.254: 13.68,41.44 13.68,40.92 13.09,40.32 13.09,40.07 13.42,39.74 13.42,39.49 12.59,38.66 12.34,38.66 12.01,38.99 11.76,38.99 10.93,38.17 10.93,37.91 11.26,37.59 11.26,37.33 10.44,36.51 10.18,36.51 9.86,36.84 9.6,36.84 6.41,33.65 6.41,29.57 7.28,28.71 9.32,28.71 9.8,29.19 11.55,29.19 11.56,29.2 ; 13.68,41.44 13.94,41.44 14.19,41.69 14.19,42.56 14.19,42.56 ; 13.68,41.44 13.48,41.44 13.2,41.72 13.2,42.35 13.2,42.36
Y_DN: length 17.4
  Top Layer w0.254: 12.66,10.54 12.66,13.39 v1(13.01,13.74)
  Bottom Layer w0.254: U2.9 13.76,27.42 13.76,16.6 13.88,16.48 13.88,15.79 13.76,15.67 13.76,14.5 v1(13.01,13.74)
Y_DP: length 17.5
  Top Layer w0.254: v1(13.13,15.45) 14.67,13.91 YubiKey.3
  Bottom Layer w0.254: U2.10 13.26,16.44 13.13,16.31 v1(13.13,15.45)
$3N2109: length 7.4
  Top Layer w0.254: v1(19.38,46.17) 19.38,45.62 18.68,44.92 16.46,44.92 15.44,43.9 v1(15.44,43.83)
  Bottom Layer w0.254: v1(15.44,43.83) 15.19,43.57 15.19,42.66 ; 19.37,46.99 19.37,46.18 v1(19.38,46.17)
$3N2111: length 7.6
  Top Layer w0.254: v1(11.68,43.82) 10.56,44.94 8.35,44.94 7.5,45.79 v1(7.5,46.15)
  Bottom Layer w0.254: 7.55,47 7.56,46.99 7.5,46.94 v1(7.5,46.15) ; 11.67,43.79 12.19,43.28 12.19,42.67 12.2,42.66
$3N2118: length 15.9
  Top Layer w0.254: v1(20.96,8.88) 20.96,6.9 18.76,4.69 16.52,4.69 12.75,8.47 12.19,8.47
  Bottom Layer w0.254: 11.91,7.27 11.91,7.28 11.91,8.31 v1(12.12,8.53) ; 20.64,7.68 20.96,8 v1(20.96,8.88)
$3N2120: length 6.7
  Top Layer w0.254: v1(19.4,8.88) 18.99,8.46 15.58,8.46 15.46,8.34
  Bottom Layer w0.254: v1(15.42,8.45) 14.92,7.95 14.92,7.39 ; v1(19.4,8.88) 19.64,8.64 19.64,7.68
$3N2134: length 3
  Top Layer w0.381: 21.43,13.76 21.8,13.76 22.75,12.81 Q1.2
$3N2136: length 3.3
  Top Layer w0.381: 23.58,6.27 23.7,6.4 Q1.3
$3N2137: length 2.6
  Top Layer w0.381: Q1.1 24.67,11.55 24.67,14.14
$3N2140: length 3.8
  Bottom Layer w0.203: 15.48,29.7 16.69,29.7 X1.2
$3N2141: length 3.7
  Bottom Layer w0.203: X1.1 16.76,29.2 15.54,29.2
$3N2147: length 2
  Bottom Layer w0.203: 9.43,29.73 9.47,29.69 11.44,29.69
$3N2150: length 4.1
  Bottom Layer w0.203: 11.54,30.67 11.08,30.67 10.49,31.26 10.49,32.55 9.54,33.5 R9.2
$3N2703: length 1.6
  Bottom Layer w0.254: 11.47,28.2 11.47,28.12 10.37,27.01

## Copper pours and planes (outline as drawn; the poured copper is in the pictures)
GND on Top Layer: -0.95,51.09 27.23,51.09 27.23,-0.39 -0.95,-0.39
GND on Bottom Layer: -3.82,54.87 29.93,54.87 29.93,-2.92 -3.82,-2.92
GND on Inner1: -3.24,51.92 29.97,51.92 29.97,-3.33 -3.24,-3.33
GND on Inner2: -4.28,53.12 32.37,53.12 32.37,-4.49 -4.28,-4.49
(no net) on Top Layer: 22.08,10.61 28.83,10.61 28.83,0.21 22.08,0.21
(no net) on Inner1: 22.08,10.6 28.83,10.6 28.83,0.2 22.08,0.2

## Text on the board
Bottom Silkscreen Layer: https://twb.prj.buglloc.com
Top Silkscreen Layer: @UTBDK | 04.2025 | rev1.0 | by | TWIBBY
